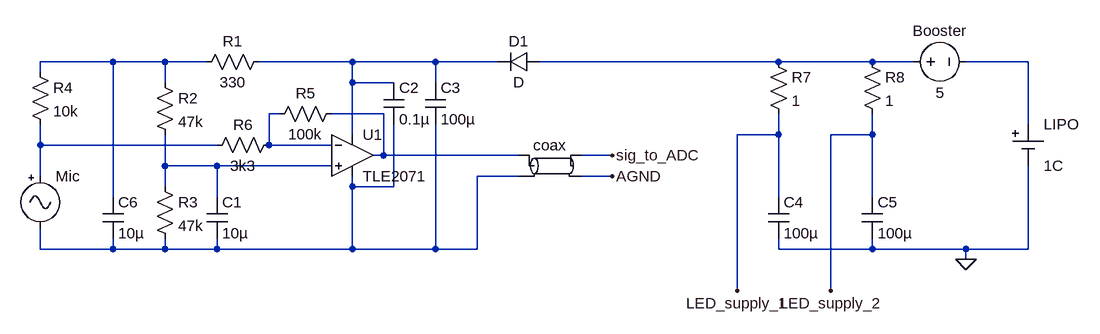
[diagram p0: schematic wand1.asc]
wand1.asc, the LTspice schematic file:
Version 4
SHEET 1 1212 680
WIRE -288 0 -400 0
WIRE -208 0 -288 0
WIRE -144 0 -208 0
WIRE 80 0 -64 0
WIRE 208 0 80 0
WIRE 304 0 208 0
WIRE 736 0 368 0
WIRE 880 0 736 0
WIRE 944 0 880 0
WIRE 1120 0 1024 0
WIRE -400 16 -400 0
WIRE -208 32 -208 0
WIRE 80 32 80 0
WIRE 144 32 80 32
WIRE 208 32 208 0
WIRE -32 80 -48 80
WIRE 128 80 48 80
WIRE 1120 96 1120 0
WIRE 80 112 80 32
WIRE 736 112 736 80
WIRE 736 112 672 112
WIRE 880 112 880 80
WIRE 880 112 816 112
WIRE -400 128 -400 96
WIRE -128 128 -400 128
WIRE -48 128 -48 80
WIRE 48 128 -48 128
WIRE 128 144 128 80
WIRE 128 144 112 144
WIRE 336 144 128 144
WIRE 480 144 432 144
WIRE -208 160 -208 112
WIRE -128 160 -208 160
WIRE 48 160 -128 160
WIRE -400 176 -400 128
WIRE 336 176 272 176
WIRE 480 176 432 176
WIRE -208 192 -208 160
WIRE 80 192 80 176
WIRE 144 192 144 96
WIRE 144 192 80 192
WIRE -288 208 -288 0
WIRE -128 208 -128 160
WIRE 736 208 736 112
WIRE 880 208 880 112
WIRE -400 288 -400 256
WIRE -288 288 -288 272
WIRE -288 288 -400 288
WIRE -208 288 -208 272
WIRE -208 288 -288 288
WIRE -128 288 -128 272
WIRE -128 288 -208 288
WIRE 80 288 80 192
WIRE 80 288 -128 288
WIRE 208 288 208 96
WIRE 208 288 80 288
WIRE 272 288 272 176
WIRE 272 288 208 288
WIRE 736 288 736 272
WIRE 880 288 880 272
WIRE 880 288 736 288
WIRE 1024 288 880 288
WIRE 1120 288 1120 160
WIRE 1120 288 1024 288
WIRE 1024 304 1024 288
WIRE 1024 304 1008 304
WIRE 672 352 672 112
WIRE 816 352 816 112
FLAG 480 144 sig_to_ADC
FLAG 1024 304 0
FLAG 480 176 AGND
FLAG 672 352 LED_supply_1
FLAG 816 352 LED_supply_2
SYMBOL Opamps\\opamp2 80 80 R0
SYMATTR InstName U1
SYMATTR Value TLE2071
SYMBOL res -48 -16 R90
WINDOW 0 0 56 VBottom 2
WINDOW 3 32 56 VTop 2
SYMATTR InstName R1
SYMATTR Value 330
SYMBOL res -224 16 R0
SYMATTR InstName R2
SYMATTR Value 47k
SYMBOL res -224 176 R0
SYMATTR InstName R3
SYMATTR Value 47k
SYMBOL res -416 0 R0
SYMATTR InstName R4
SYMATTR Value 10k
SYMBOL cap -144 208 R0
SYMATTR InstName C1
SYMATTR Value 10µ
SYMBOL diode 368 -16 R90
WINDOW 0 0 32 VBottom 2
WINDOW 3 32 32 VTop 2
SYMATTR InstName D1
SYMBOL cap 128 32 R0
SYMATTR InstName C2
SYMATTR Value 0.1µ
SYMBOL cap 192 32 R0
SYMATTR InstName C3
SYMATTR Value 100µ
SYMBOL res 64 64 R90
WINDOW 0 0 56 VBottom 2
WINDOW 3 32 56 VTop 2
SYMATTR InstName R5
SYMATTR Value 100k
SYMBOL res -32 112 R90
WINDOW 0 0 56 VBottom 2
WINDOW 3 32 56 VTop 2
SYMATTR InstName R6
SYMATTR Value 3k3
SYMBOL Misc\\signal -400 160 R0
WINDOW 123 0 0 Left 2
WINDOW 39 0 0 Left 2
SYMATTR InstName Mic
SYMATTR Value ""
SYMBOL res 720 -16 R0
SYMATTR InstName R7
SYMATTR Value 1
SYMBOL res 864 -16 R0
SYMATTR InstName R8
SYMATTR Value 1
SYMBOL cap 720 208 R0
SYMATTR InstName C4
SYMATTR Value 100µ
SYMBOL cap 864 208 R0
SYMATTR InstName C5
SYMATTR Value 100µ
SYMBOL tline 384 160 R0
SYMATTR InstName coax
SYMATTR Value ""
SYMBOL voltage 928 0 R270
WINDOW 0 32 56 VTop 2
WINDOW 3 -32 56 VBottom 2
WINDOW 123 0 0 Left 2
WINDOW 39 0 0 Left 2
SYMATTR InstName Booster
SYMATTR Value 5
SYMBOL Misc\\cell 1120 96 R0
WINDOW 123 0 0 Left 2
WINDOW 39 0 0 Left 2
SYMATTR InstName LIPO
SYMATTR Value 1C
SYMBOL cap -304 208 R0
SYMATTR InstName C6
SYMATTR Value 10µ

The netlist it stands for:
* wand1.asc
XU1 N008 N005 N002 N009 N006 TLE2071  ; pins In+ In- V+ V- OUT
R1 N002 N001 330
R2 N001 N008 47k
R3 N008 N009 47k
R4 N001 N007 10k
C1 N008 N009 10µ
D1 N003 N002 D
C2 N002 N009 0.1µ
C3 N002 N009 100µ
R5 N006 N005 100k
R6 N005 N007 3k3
V§Mic N007 N009
R7 N003 LED_supply_1 1
R8 N003 LED_supply_2 1
C4 LED_supply_1 0 100µ
C5 LED_supply_2 0 100µ
T§coax N006 N009 sig_to_ADC AGND
V§Booster N003 N004 5
V§LIPO N004 0 1C
C6 N001 N009 10µ
.model D D
.lib standard.dio
.backanno
.end